# EAGLE schematic OpenDeck-r1.2.2 (EAGLE 7.4.0)
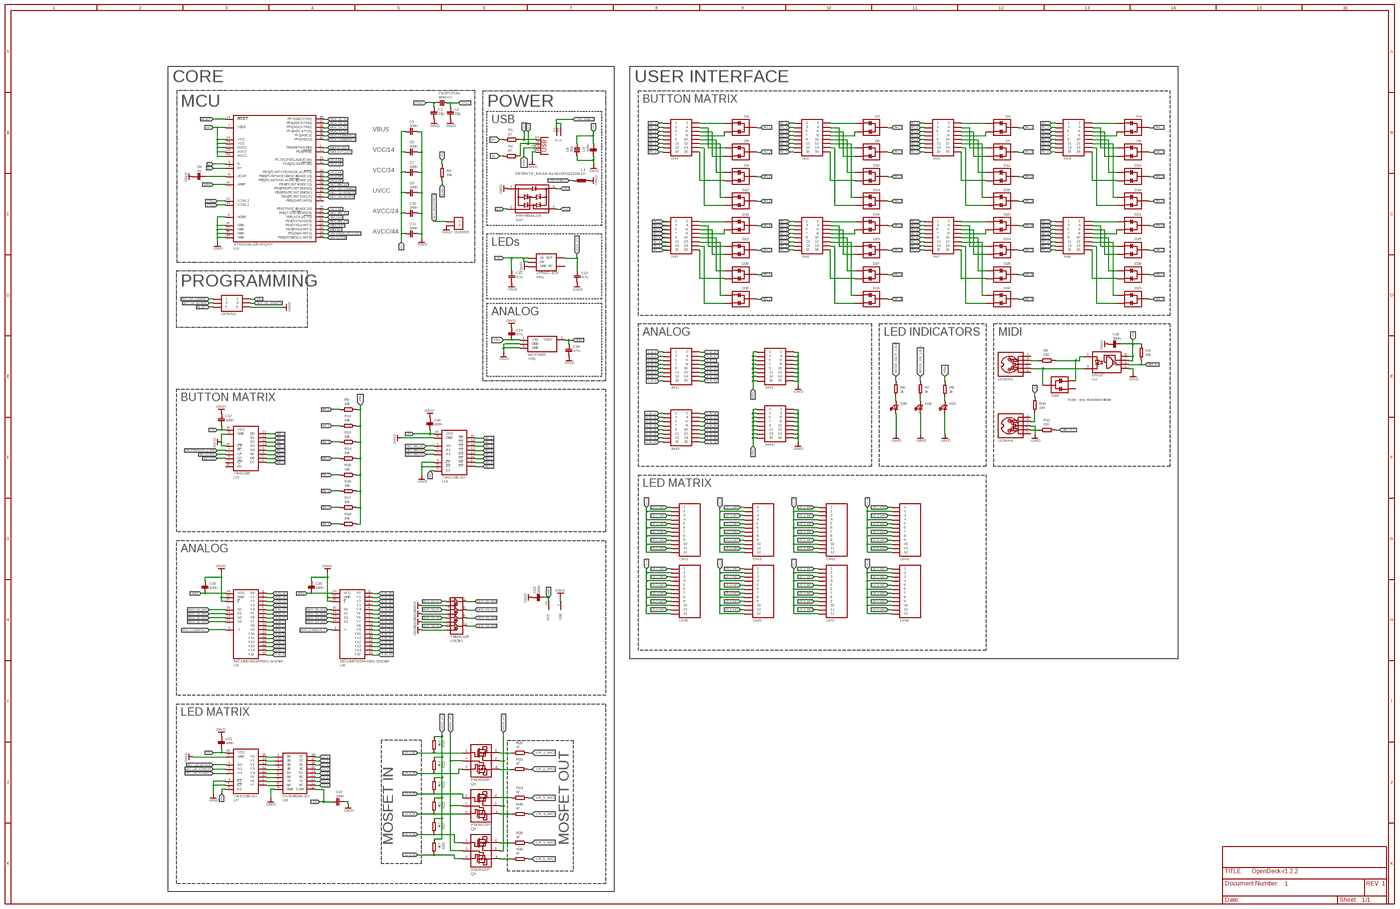
[diagram p0: schematic, sheet 1, overview]
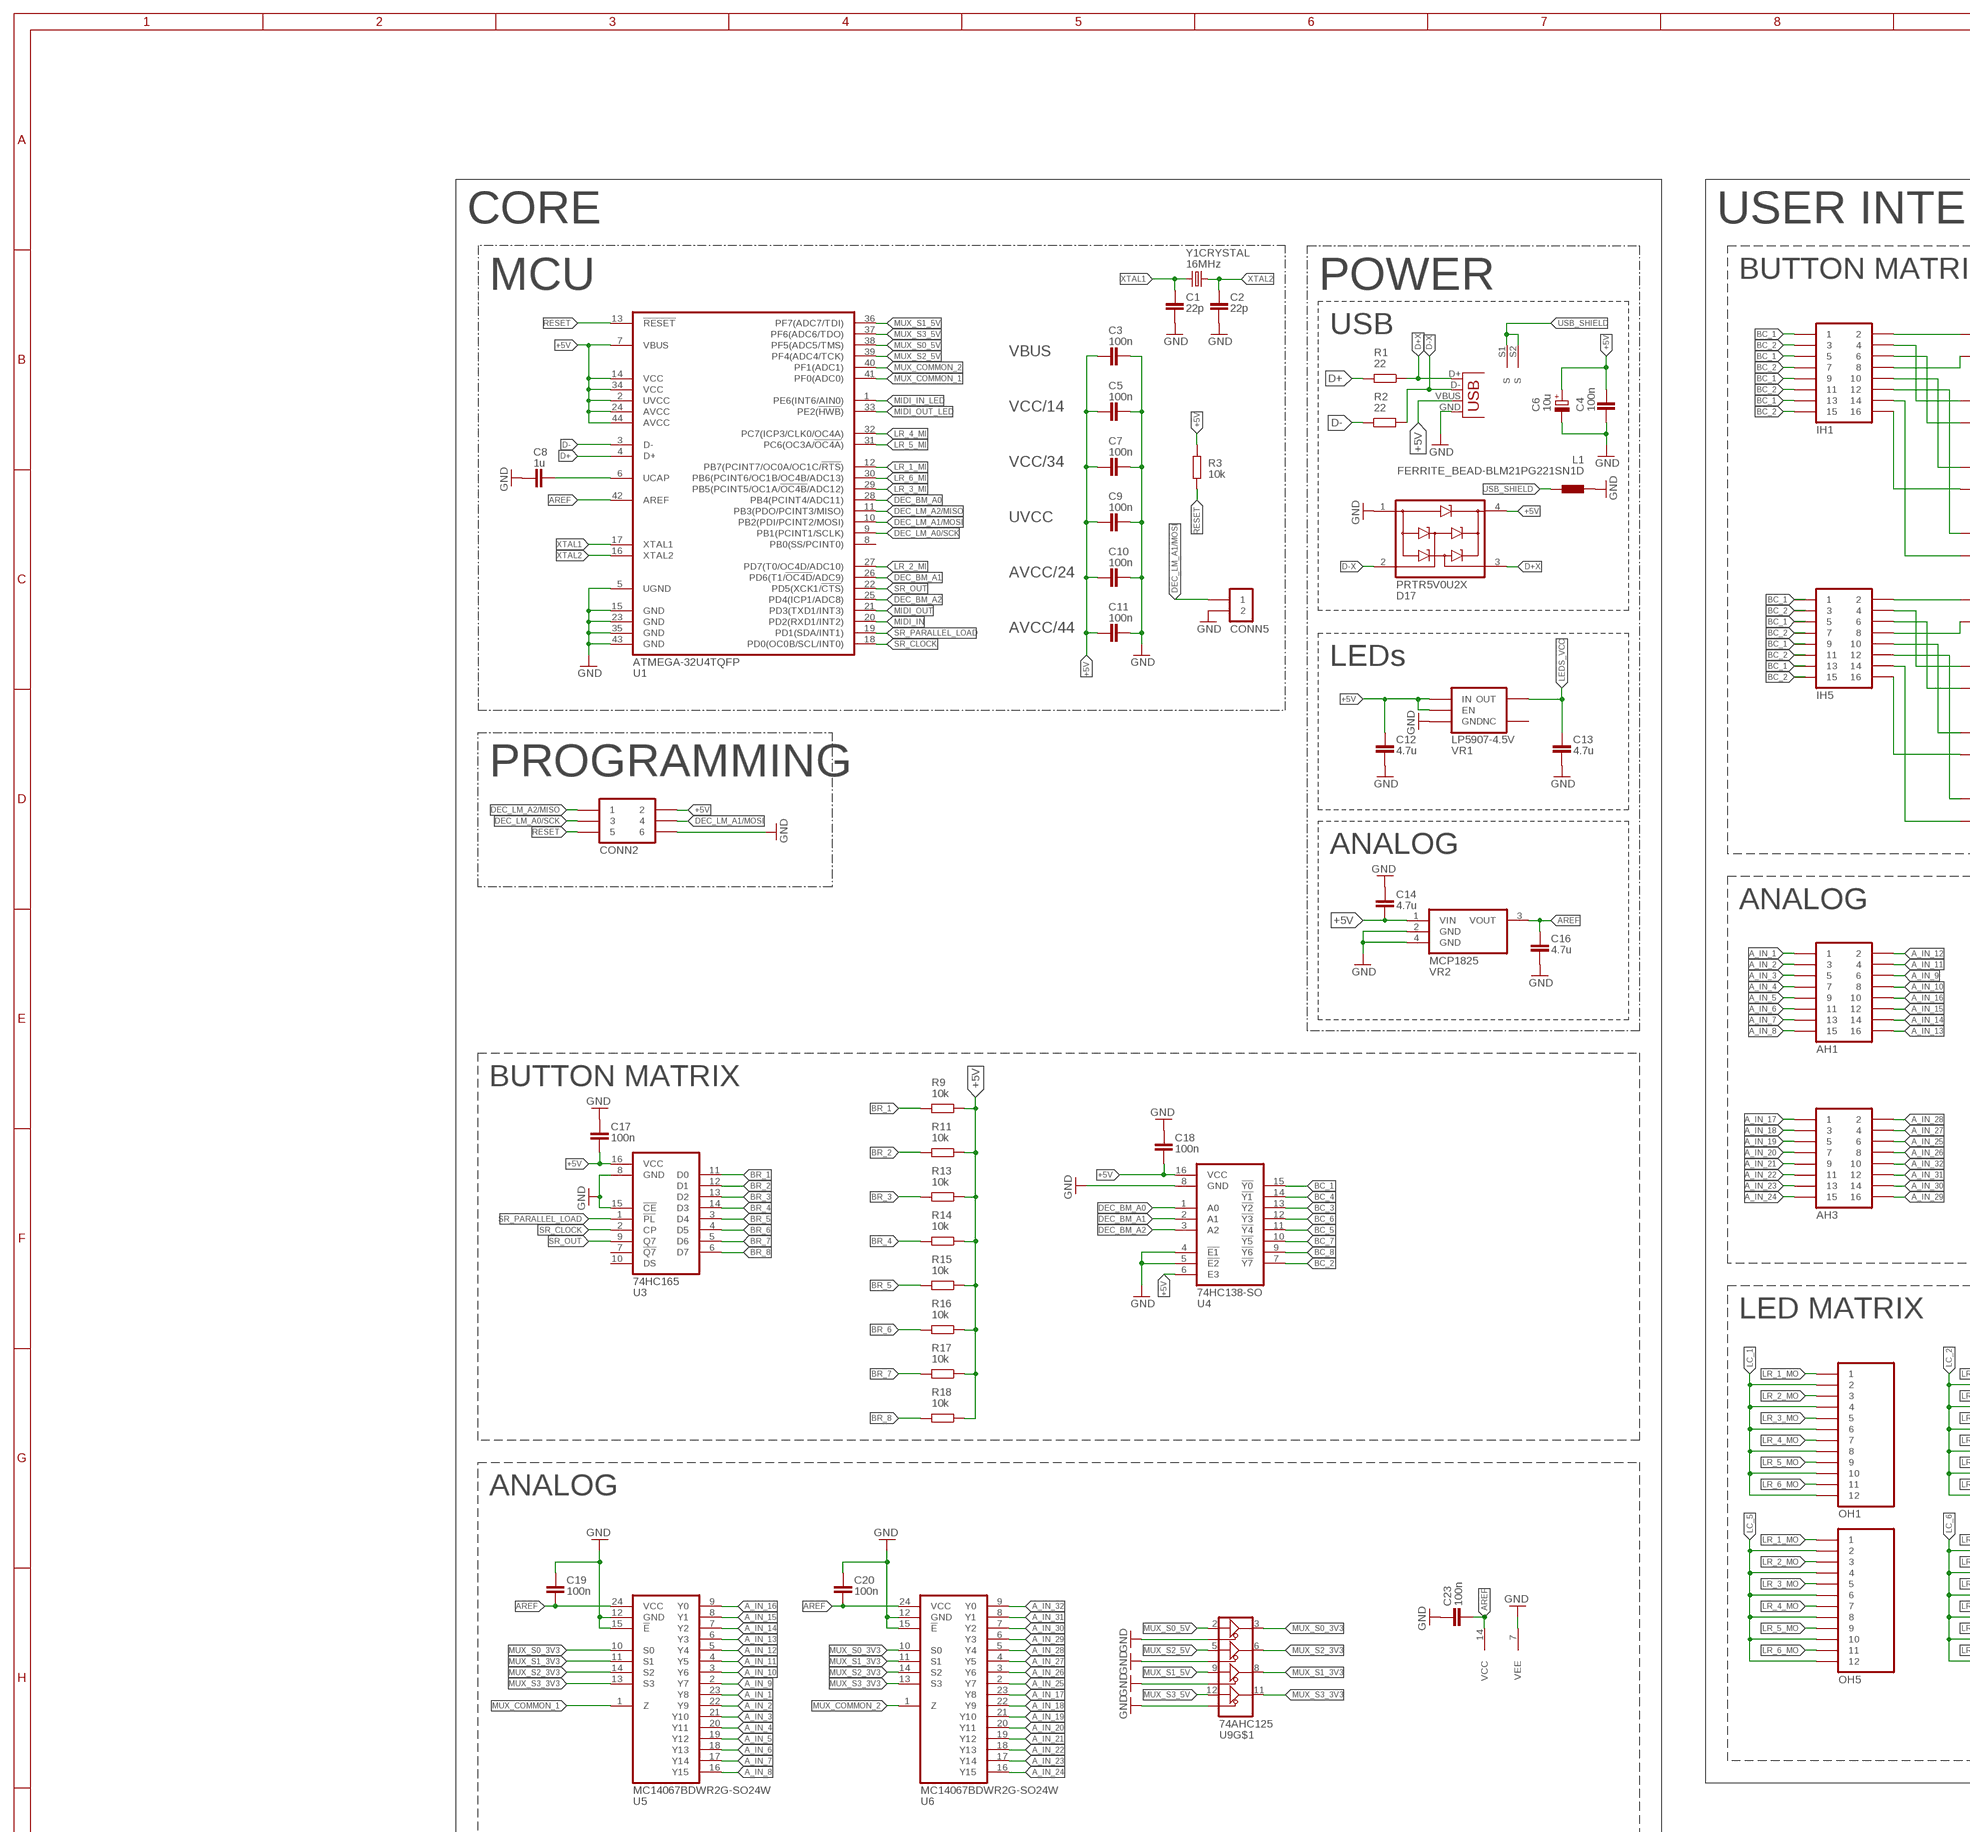
[diagram p1: schematic, sheet 1, part 1 of 4]
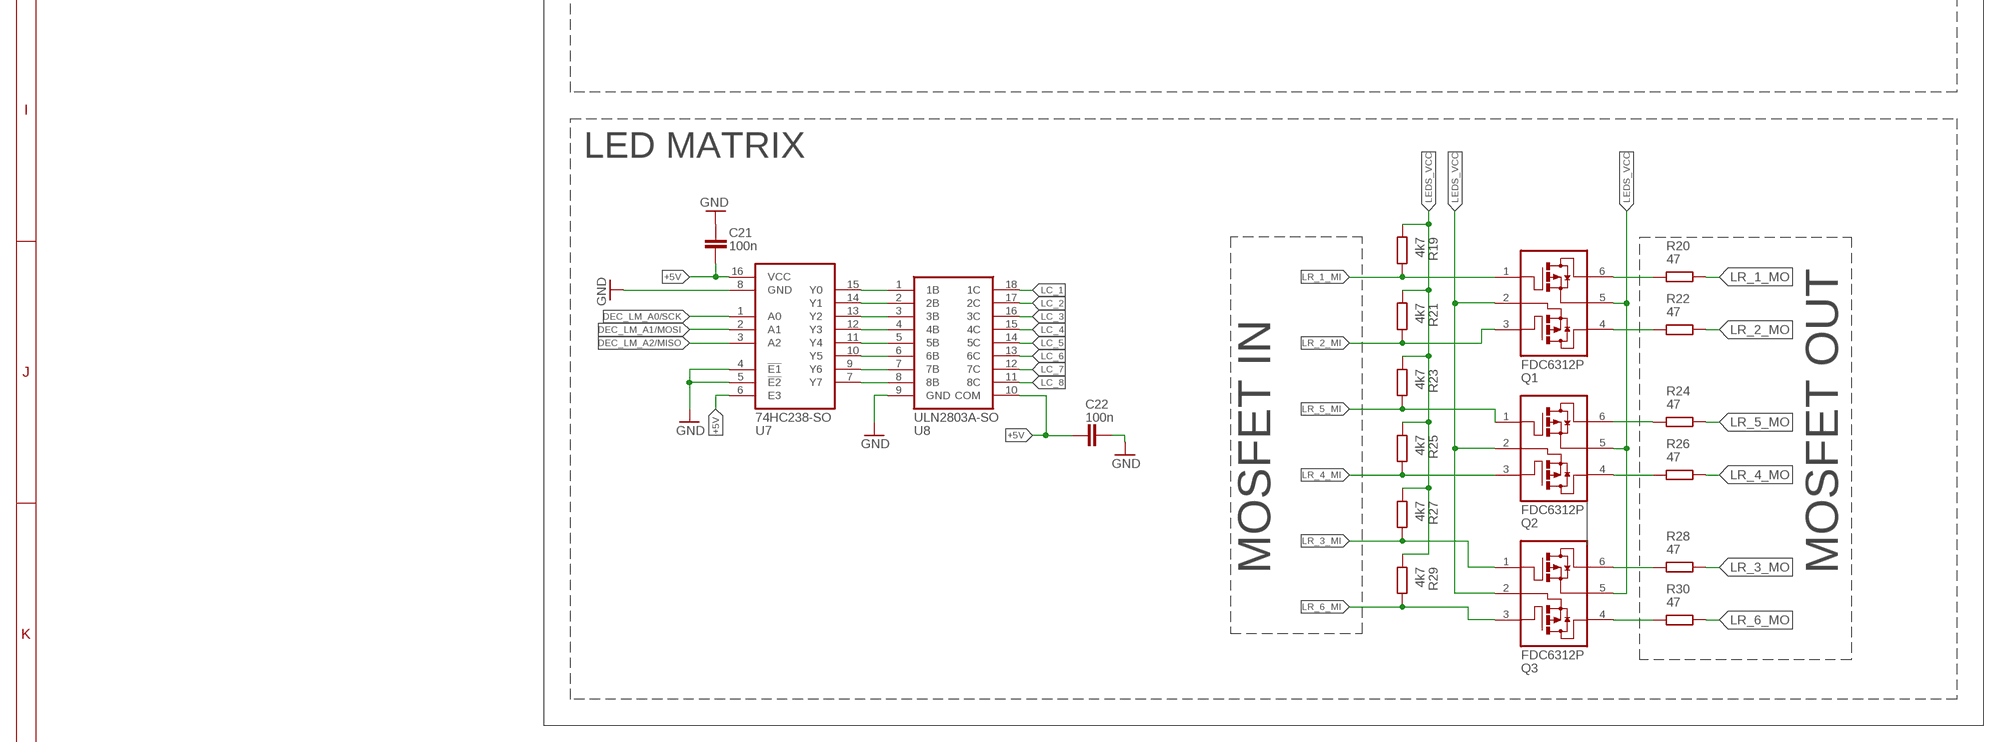
[diagram p2: schematic, sheet 1, part 2 of 4]
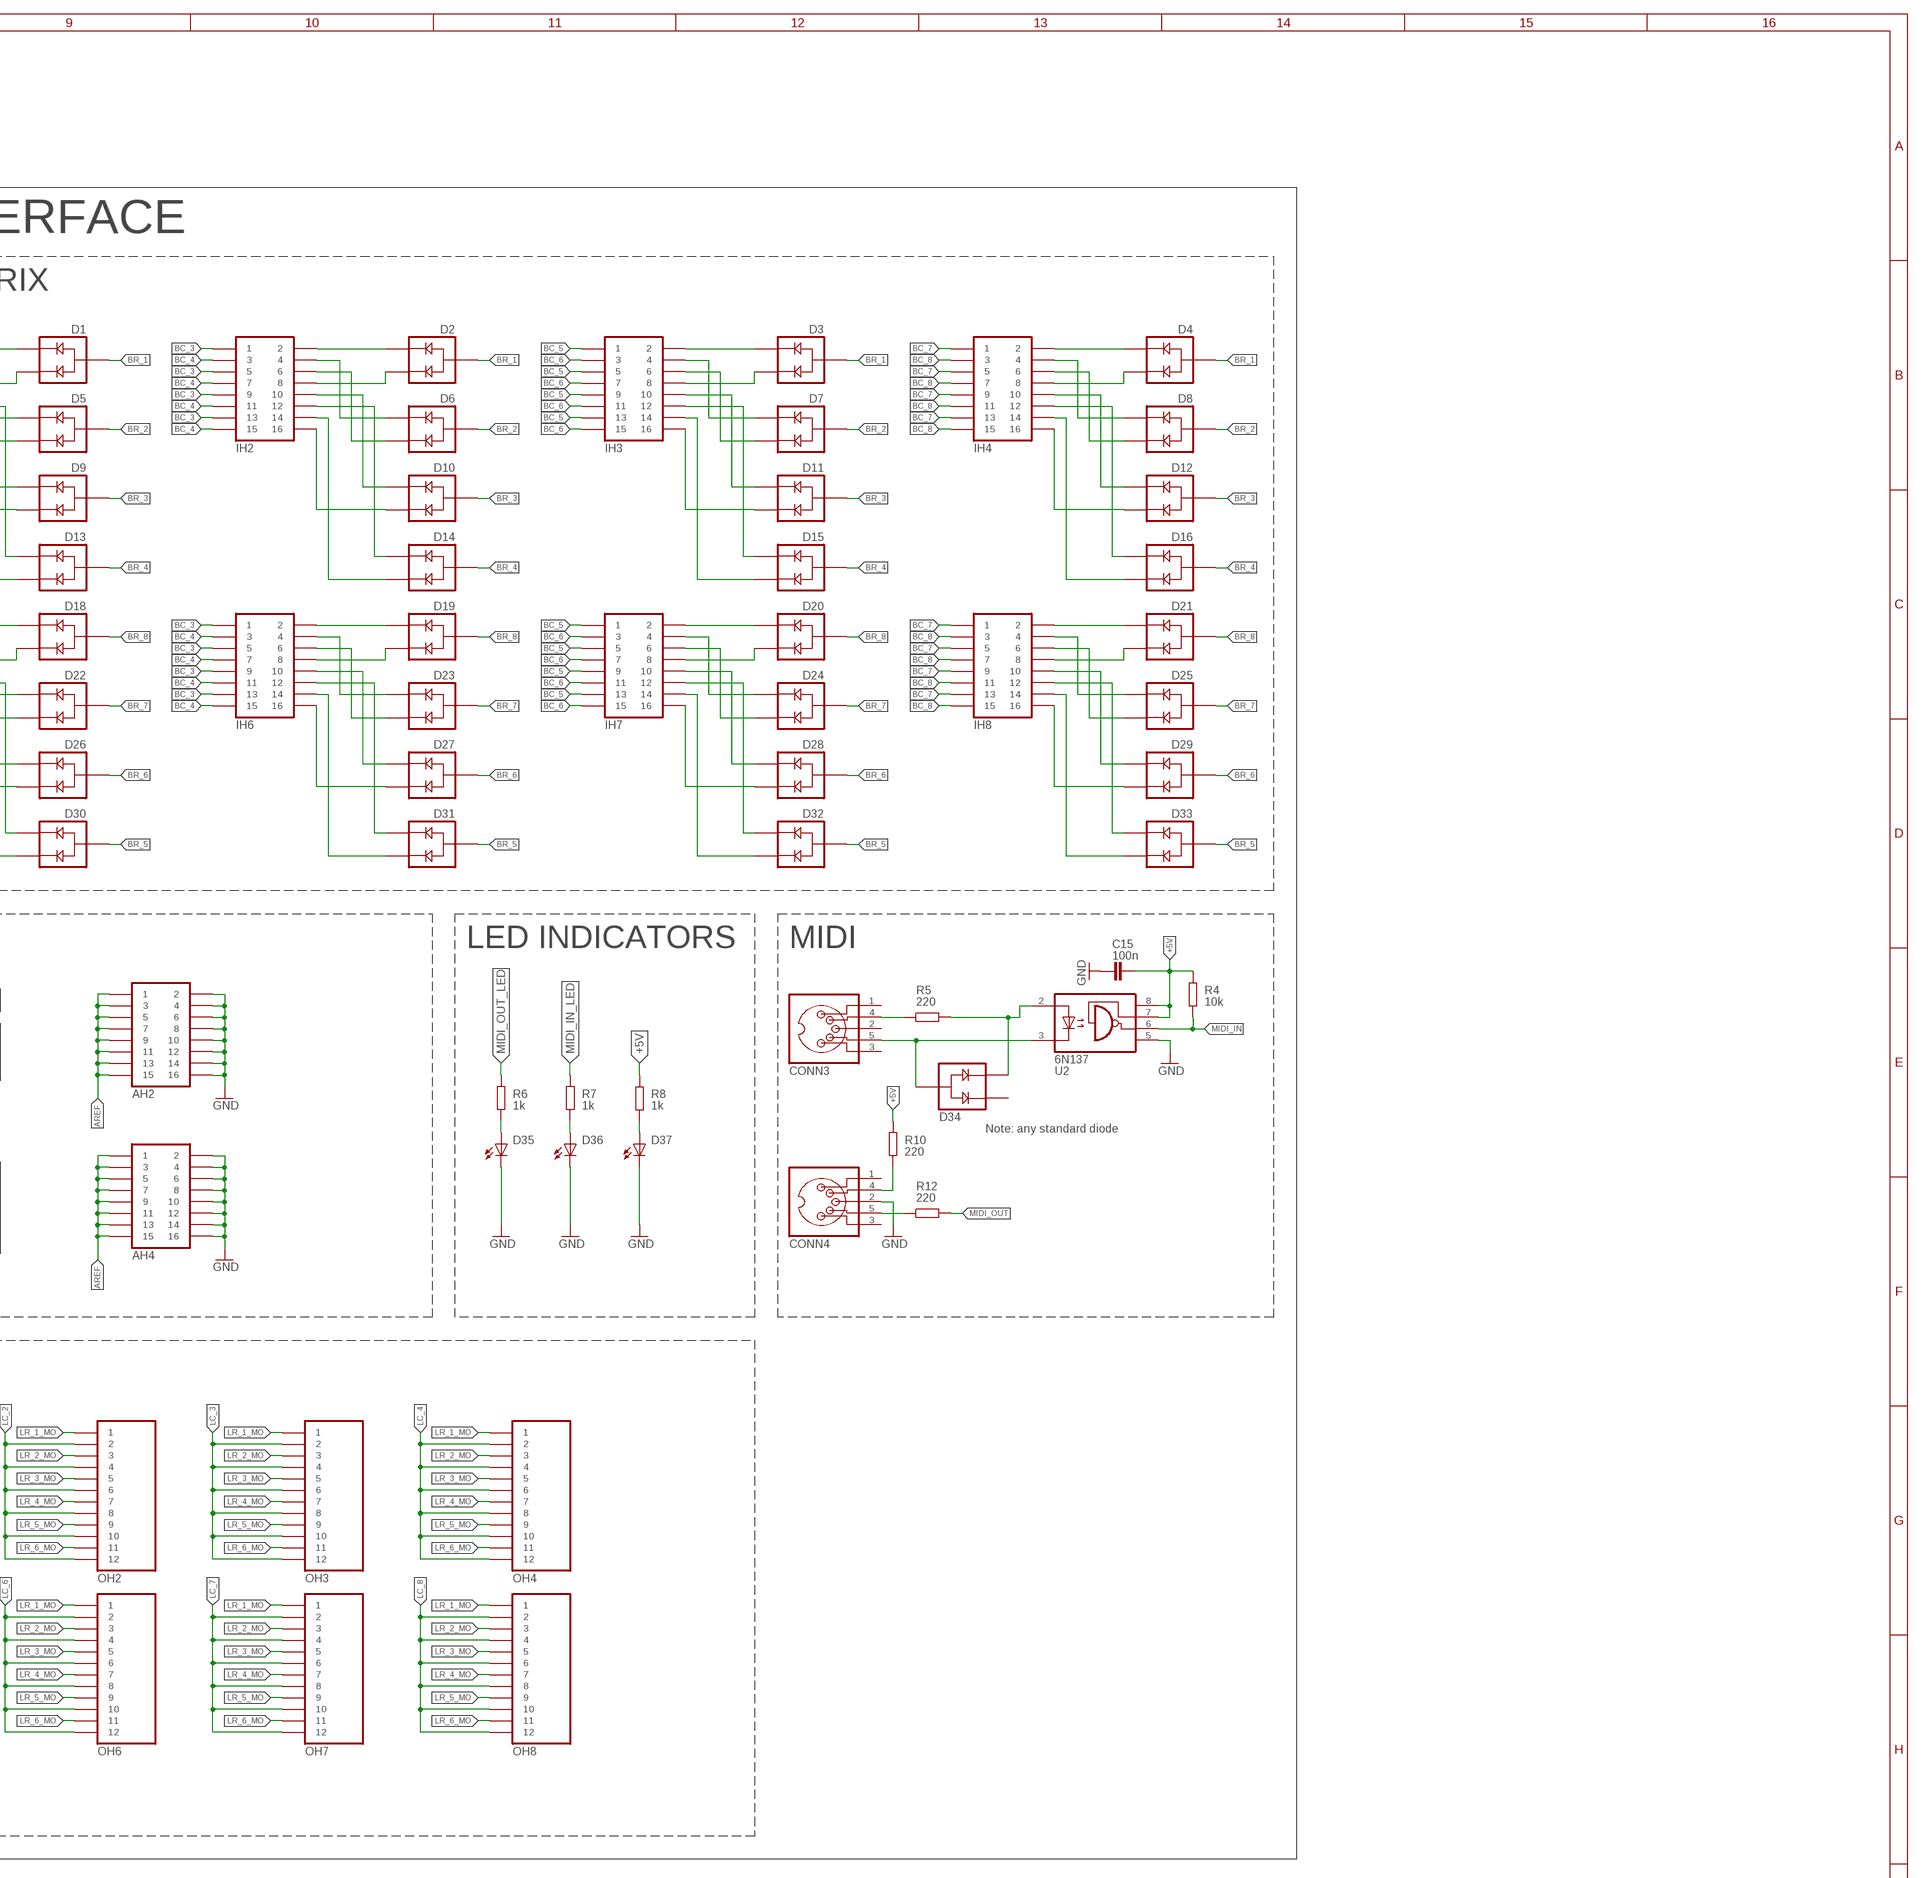
[diagram p3: schematic, sheet 1, part 3 of 4]
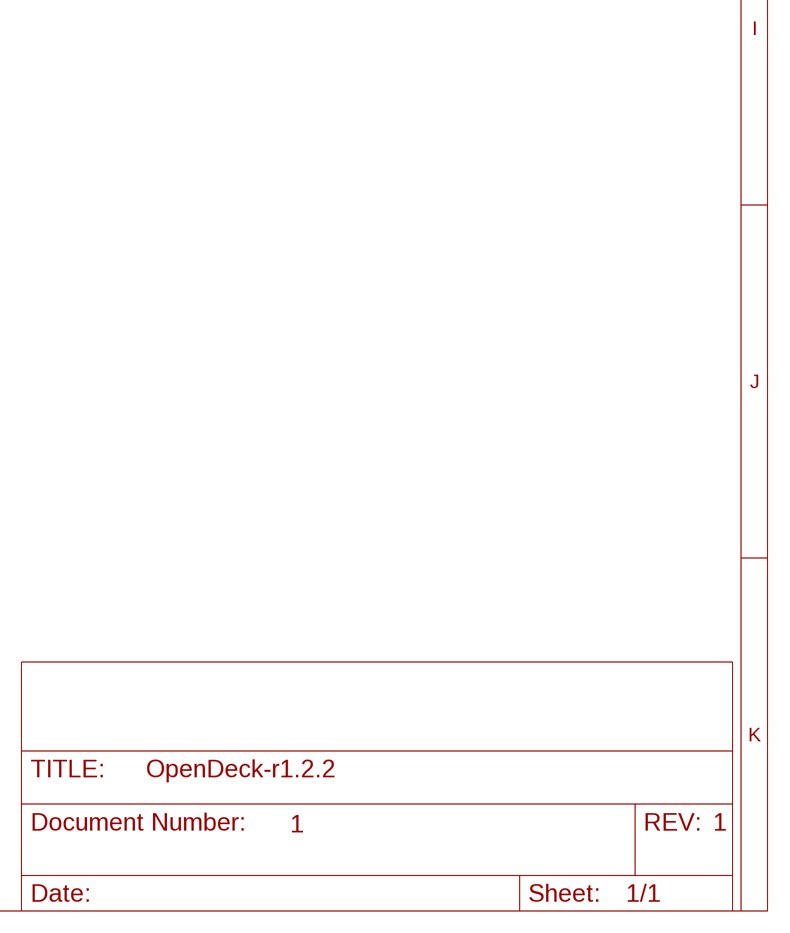
[diagram p4: schematic, sheet 1, part 4 of 4]

## Parts
AH1  PINHD-2X08-TH-2.54MM  [2X08-2.54]
AH2  PINHD-2X08-TH-2.54MM  [2X08-2.54]
AH3  PINHD-2X08-TH-2.54MM  [2X08-2.54]
AH4  PINHD-2X08-TH-2.54MM  [2X08-2.54]
C1  22p  CAPACITOR-0603  [C0603]
C2  22p  CAPACITOR-0603  [C0603]
C3  100n  CAPACITOR-0603  [C0603]
C4  100n  CAPACITOR-0603  [C0603]
C5  100n  CAPACITOR-0603  [C0603]
C6  10u  ELECTROLYTIC_CAPACITOR16V-CLV-0405  [153CLV-0405]
C7  100n  CAPACITOR-0603  [C0603]
C8  1u  CAPACITOR-0603  [C0603]
C9  100n  CAPACITOR-0603  [C0603]
C10  100n  CAPACITOR-0603  [C0603]
C11  100n  CAPACITOR-0603  [C0603]
C12  4.7u  CAPACITOR-0603  [C0603]
C13  4.7u  CAPACITOR-0603  [C0603]
C14  4.7u  CAPACITOR-0603  [C0603]
C15  100n  CAPACITOR-0603  [C0603]
C16  4.7u  CAPACITOR-0603  [C0603]
C17  100n  CAPACITOR-0603  [C0603]
C18  100n  CAPACITOR-0603  [C0603]
C19  100n  CAPACITOR-0603  [C0603]
C20  100n  CAPACITOR-0603  [C0603]
C21  100n  CAPACITOR-0603  [C0603]
C22  100n  CAPACITOR-0603  [C0603]
C23  100n  CAPACITOR-0603  [C0603]
CONN1  USB-B-PTH  [USB-B-PTH]
CONN2  PINHD-2X03-TH-2.54MM-V  [2X03-2.54-V]
CONN3  MIDI_CONN-STD  [DIN5_SUPPORT]
CONN4  MIDI_CONN-STD  [DIN5_SUPPORT]
CONN5  PINHD-1X02-TH-2.54MM  [1X02-2.54-V]
D1  BAW56  [SOT23]
D2  BAW56  [SOT23]
D3  BAW56  [SOT23]
D4  BAW56  [SOT23]
D5  BAW56  [SOT23]
D6  BAW56  [SOT23]
D7  BAW56  [SOT23]
D8  BAW56  [SOT23]
D9  BAW56  [SOT23]
D10  BAW56  [SOT23]
D11  BAW56  [SOT23]
D12  BAW56  [SOT23]
D13  BAW56  [SOT23]
D14  BAW56  [SOT23]
D15  BAW56  [SOT23]
D16  BAW56  [SOT23]
D17  PRTR5V0U2X  [SOT143]
D18  BAW56  [SOT23]
D19  BAW56  [SOT23]
D20  BAW56  [SOT23]
D21  BAW56  [SOT23]
D22  BAW56  [SOT23]
D23  BAW56  [SOT23]
D24  BAW56  [SOT23]
D25  BAW56  [SOT23]
D26  BAW56  [SOT23]
D27  BAW56  [SOT23]
D28  BAW56  [SOT23]
D29  BAW56  [SOT23]
D30  BAW56  [SOT23]
D31  BAW56  [SOT23]
D32  BAW56  [SOT23]
D33  BAW56  [SOT23]
D34  BAW56  [SOT23]
D35  Red  LED-0805  [0805_LED]
D36  Yellow  LED-0805  [0805_LED]
D37  Green  LED-0805  [0805_LED]
IH1  PINHD-2X08-TH-2.54MM  [2X08-2.54]
IH2  PINHD-2X08-TH-2.54MM  [2X08-2.54]
IH3  PINHD-2X08-TH-2.54MM  [2X08-2.54]
IH4  PINHD-2X08-TH-2.54MM  [2X08-2.54]
IH5  PINHD-2X08-TH-2.54MM  [2X08-2.54]
IH6  PINHD-2X08-TH-2.54MM  [2X08-2.54]
IH7  PINHD-2X08-TH-2.54MM  [2X08-2.54]
IH8  PINHD-2X08-TH-2.54MM  [2X08-2.54]
L1  FERRITE_BEAD-BLM21PG221SN1D  [L0805]
OH1  PINHD-2X06-TH-2.54MM  [2X06-2.54-V]
OH2  PINHD-2X06-TH-2.54MM  [2X06-2.54-V]
OH3  PINHD-2X06-TH-2.54MM  [2X06-2.54-V]
OH4  PINHD-2X06-TH-2.54MM  [2X06-2.54-V]
OH5  PINHD-2X06-TH-2.54MM  [2X06-2.54-V]
OH6  PINHD-2X06-TH-2.54MM  [2X06-2.54-V]
OH7  PINHD-2X06-TH-2.54MM  [2X06-2.54-V]
OH8  PINHD-2X06-TH-2.54MM  [2X06-2.54-V]
Q1  FDC6312P  [SSOT6]
Q2  FDC6312P  [SSOT6]
Q3  FDC6312P  [SSOT6]
R1  22  RESISTOR-0603  [R0603]
R2  22  RESISTOR-0603  [R0603]
R3  10k  RESISTOR-0603  [R0603]
R4  10k  RESISTOR-0603  [R0603]
R5  220  RESISTOR-0603  [R0603]
R6  1k  RESISTOR-0603  [R0603]
R7  1k  RESISTOR-0603  [R0603]
R8  1k  RESISTOR-0603  [R0603]
R9  10k  RESISTOR-0603  [R0603]
R10  220  RESISTOR-0603  [R0603]
R11  10k  RESISTOR-0603  [R0603]
R12  220  RESISTOR-0603  [R0603]
R13  10k  RESISTOR-0603  [R0603]
R14  10k  RESISTOR-0603  [R0603]
R15  10k  RESISTOR-0603  [R0603]
R16  10k  RESISTOR-0603  [R0603]
R17  10k  RESISTOR-0603  [R0603]
R18  10k  RESISTOR-0603  [R0603]
R19  4k7  RESISTOR-0603  [R0603]
R20  47  RESISTOR-0603  [R0603]
R21  4k7  RESISTOR-0603  [R0603]
R22  47  RESISTOR-0603  [R0603]
R23  4k7  RESISTOR-0603  [R0603]
R24  47  RESISTOR-0603  [R0603]
R25  4k7  RESISTOR-0603  [R0603]
R26  47  RESISTOR-0603  [R0603]
R27  4k7  RESISTOR-0603  [R0603]
R28  47  RESISTOR-0603  [R0603]
R29  4k7  RESISTOR-0603  [R0603]
R30  47  RESISTOR-0603  [R0603]
U1  ATMEGA-32U4TQFP  [TQFP-44]
U2  6N137  [DIL08]
U3  74HC165  [SO16]
U4  74HC138-SO  [SO16]
U5  MC14067BDWR2G-SO24W  [SO24-W]
U6  MC14067BDWR2G-SO24W  [SO24-W]
U7  74HC238-SO  [SO16]
U8  ULN2803A-SO  [SO18]
U9  74AHC125  [SOIC14]
VR1  LP5907-4.5V  [SOT23-5]
VR2  MCP1825  [SOT223]
Y1  16MHz  CRYSTAL-4P-SMD-3.2X2.5  [CRYSTAL-SMD-3.2X2.5]

## Nets
+5V [vcc]: C3.1 C4.2 C5.1 C6.+ C7.1 C9.1 C10.1 C11.1 C12.1 C14.1 C15.2 C17.2 C18.2 C21.1 C22.1 CONN1.VBUS CONN2.2 D17.4(VCC) R3.1 R4.1 R8.1 R9.1 R10.2 R11.1 R13.1 R14.1 R15.1 R16.1 R17.1 R18.1 U1.2(UVCC) U1.7(VBUS) U1.14(VCC) U1.24(AVCC) U1.34(VCC) U1.44(AVCC) U2.7(VE) U2.8(VCC) U3.16(VCC) U4.6(E3) U4.16(VCC) U7.6(E3) U7.16(VCC) U8.10(COM) VR1.1(IN) VR1.3(EN) VR2.1(VIN)
A_IN_1: AH1.1 U5.23(Y8)
A_IN_2: AH1.3 U5.22(Y9)
A_IN_3: AH1.5 U5.21(Y10)
A_IN_4: AH1.7 U5.20(Y11)
A_IN_5: AH1.9 U5.19(Y12)
A_IN_6: AH1.11 U5.18(Y13)
A_IN_7: AH1.13 U5.17(Y14)
A_IN_8: AH1.15 U5.16(Y15)
A_IN_9: AH1.6 U5.2(Y7)
A_IN_10: AH1.8 U5.3(Y6)
A_IN_11: AH1.4 U5.4(Y5)
A_IN_12: AH1.2 U5.5(Y4)
A_IN_13: AH1.16 U5.6(Y3)
A_IN_14: AH1.14 U5.7(Y2)
A_IN_15: AH1.12 U5.8(Y1)
A_IN_16: AH1.10 U5.9(Y0)
A_IN_17: AH3.1 U6.23(Y8)
A_IN_18: AH3.3 U6.22(Y9)
A_IN_19: AH3.5 U6.21(Y10)
A_IN_20: AH3.7 U6.20(Y11)
A_IN_21: AH3.9 U6.19(Y12)
A_IN_22: AH3.11 U6.18(Y13)
A_IN_23: AH3.13 U6.17(Y14)
A_IN_24: AH3.15 U6.16(Y15)
A_IN_25: AH3.6 U6.2(Y7)
A_IN_26: AH3.8 U6.3(Y6)
A_IN_27: AH3.4 U6.4(Y5)
A_IN_28: AH3.2 U6.5(Y4)
A_IN_29: AH3.16 U6.6(Y3)
A_IN_30: AH3.14 U6.7(Y2)
A_IN_31: AH3.12 U6.8(Y1)
A_IN_32: AH3.10 U6.9(Y0)
AREF: AH2.1 AH2.3 AH2.5 AH2.7 AH2.9 AH2.11 AH2.13 AH2.15 AH4.1 AH4.3 AH4.5 AH4.7 AH4.9 AH4.11 AH4.13 AH4.15 C16.1 C19.2 C20.2 C23.2 U1.42(AREF) U5.24(VCC) U6.24(VCC) U9.14(VCC) VR2.3(VOUT)
BC_1: IH1.1 IH1.5 IH1.9 IH1.13 IH5.1 IH5.5 IH5.9 IH5.13 U4.15(!Y0)
BC_2: IH1.3 IH1.7 IH1.11 IH1.15 IH5.3 IH5.7 IH5.11 IH5.15 U4.7(!Y7)
BC_3: IH2.1 IH2.5 IH2.9 IH2.13 IH6.1 IH6.5 IH6.9 IH6.13 U4.13(!Y2)
BC_4: IH2.3 IH2.7 IH2.11 IH2.15 IH6.3 IH6.7 IH6.11 IH6.15 U4.14(!Y1)
BC_5: IH3.1 IH3.5 IH3.9 IH3.13 IH7.1 IH7.5 IH7.9 IH7.13 U4.11(!Y4)
BC_6: IH3.3 IH3.7 IH3.11 IH3.15 IH7.3 IH7.7 IH7.11 IH7.15 U4.12(!Y3)
BC_7: IH4.1 IH4.5 IH4.9 IH4.13 IH8.1 IH8.5 IH8.9 IH8.13 U4.10(!Y5)
BC_8: IH4.3 IH4.7 IH4.11 IH4.15 IH8.3 IH8.7 IH8.11 IH8.15 U4.9(!Y6)
BR_1: D1.3 D2.3 D3.3 D4.3 R9.2 U3.11(D0)
BR_2: D5.3 D6.3 D7.3 D8.3 R11.2 U3.12(D1)
BR_3: D9.3 D10.3 D11.3 D12.3 R13.2 U3.13(D2)
BR_4: D13.3 D14.3 D15.3 D16.3 R14.2 U3.14(D3)
BR_5: D30.3 D31.3 D32.3 D33.3 R15.2 U3.3(D4)
BR_6: D26.3 D27.3 D28.3 D29.3 R16.2 U3.4(D5)
BR_7: D22.3 D23.3 D24.3 D25.3 R17.2 U3.5(D6)
BR_8: D18.3 D19.3 D20.3 D21.3 R18.2 U3.6(D7)
D+: R1.2 U1.4(D+)
D+X: CONN1.D+ D17.3(I/O2) R1.1
D-: R2.1 U1.3(D-)
D-X: CONN1.D- D17.2(I/O1) R2.2
DEC_BM_A0: U1.28(PB4(PCINT4/ADC11)) U4.1(A0)
DEC_BM_A1: U1.26(PD6(T1/!OC4D!/ADC9)) U4.2(A1)
DEC_BM_A2: U1.25(PD4(ICP1/ADC8)) U4.3(A2)
DEC_LM_A0/SCK: CONN2.3 U1.9(PB1(PCINT1/SCLK)) U7.1(A0)
DEC_LM_A1/MOSI: CONN2.4 CONN5.1 U1.10(PB2(PDI/PCINT2/MOSI)) U7.2(A1)
DEC_LM_A2/MISO: CONN2.1 U1.11(PB3(PDO/PCINT3/MISO)) U7.3(A2)
DEC_LM_Y0: U7.15(Y0) U8.1(1B)
DEC_LM_Y1: U7.14(Y1) U8.2(2B)
DEC_LM_Y2: U7.13(Y2) U8.3(3B)
DEC_LM_Y3: U7.12(Y3) U8.4(4B)
DEC_LM_Y4: U7.11(Y4) U8.5(5B)
DEC_LM_Y5: U7.10(Y5) U8.6(6B)
DEC_LM_Y6: U7.9(Y6) U8.7(7B)
DEC_LM_Y7: U7.7(Y7) U8.8(8B)
GND: AH2.2 AH2.4 AH2.6 AH2.8 AH2.10 AH2.12 AH2.14 AH2.16 AH4.2 AH4.4 AH4.6 AH4.8 AH4.10 AH4.12 AH4.14 AH4.16 C1.2 C2.2 C3.2 C4.1 C5.2 C6.- C7.2 C8.2 C9.2 C10.2 C11.2 C12.2 C13.2 C14.2 C15.1 C16.2 C17.1 C18.1 C19.1 C20.1 C21.2 C22.2 C23.1 CONN1.GND CONN2.6 CONN4.2 CONN5.2 D17.1(GND) D35.C D36.C D37.C L1.1 U1.5(UGND) U1.15(GND) U1.23(GND) U1.35(GND) U1.43(GND) U2.5(GND) U3.8(GND) U3.15(!CE) U4.4(!E1) U4.5(!E2) U4.8(GND) U5.12(GND) U5.15(!E) U6.12(GND) U6.15(!E) U7.4(!E1) U7.5(!E2) U7.8(GND) U8.9(GND) U9.1(1!(OE)) U9.4(2!(OE)) U9.7(VEE) U9.10(3!(OE)) U9.13(4!(OE)) VR1.2(GND) VR2.2(GND) VR2.4(GND)
IH1_2: D1.1 IH1.2
IH1_4: D5.1 IH1.4
IH1_6: D5.2 IH1.6
IH1_8: D1.2 IH1.8
IH1_10: D9.1 IH1.10
IH1_12: D13.1 IH1.12
IH1_14: D13.2 IH1.14
IH1_16: D9.2 IH1.16
IH2_2: D2.1 IH2.2
IH2_4: D6.1 IH2.4
IH2_6: D6.2 IH2.6
IH2_8: D2.2 IH2.8
IH2_10: D10.1 IH2.10
IH2_12: D14.1 IH2.12
IH2_14: D14.2 IH2.14
IH2_16: D10.2 IH2.16
IH3_2: D3.1 IH3.2
IH3_4: D7.1 IH3.4
IH3_6: D7.2 IH3.6
IH3_8: D3.2 IH3.8
IH3_10: D11.1 IH3.10
IH3_12: D15.1 IH3.12
IH3_14: D15.2 IH3.14
IH3_16: D11.2 IH3.16
IH4_2: D4.1 IH4.2
IH4_4: D8.1 IH4.4
IH4_6: D8.2 IH4.6
IH4_8: D4.2 IH4.8
IH4_10: D12.1 IH4.10
IH4_12: D16.1 IH4.12
IH4_14: D16.2 IH4.14
IH4_16: D12.2 IH4.16
IH5_2: D18.1 IH5.2
IH5_4: D22.1 IH5.4
IH5_6: D22.2 IH5.6
IH5_8: D18.2 IH5.8
IH5_10: D26.1 IH5.10
IH5_12: D30.1 IH5.12
IH5_14: D30.2 IH5.14
IH5_16: D26.2 IH5.16
IH6_2: D19.1 IH6.2
IH6_4: D23.1 IH6.4
IH6_6: D23.2 IH6.6
IH6_8: D19.2 IH6.8
IH6_10: D27.1 IH6.10
IH6_12: D31.1 IH6.12
IH6_14: D31.2 IH6.14
IH6_16: D27.2 IH6.16
IH7_2: D20.1 IH7.2
IH7_4: D24.1 IH7.4
IH7_6: D24.2 IH7.6
IH7_8: D20.2 IH7.8
IH7_10: D28.1 IH7.10
IH7_12: D32.1 IH7.12
IH7_14: D32.2 IH7.14
IH7_16: D28.2 IH7.16
IH8_2: D21.1 IH8.2
IH8_4: D25.1 IH8.4
IH8_6: D25.2 IH8.6
IH8_8: D21.2 IH8.8
IH8_10: D29.1 IH8.10
IH8_12: D33.1 IH8.12
IH8_14: D33.2 IH8.14
IH8_16: D29.2 IH8.16
LC_1: OH1.2 OH1.4 OH1.6 OH1.8 OH1.10 OH1.12 U8.18(1C)
LC_2: OH2.2 OH2.4 OH2.6 OH2.8 OH2.10 OH2.12 U8.17(2C)
LC_3: OH3.2 OH3.4 OH3.6 OH3.8 OH3.10 OH3.12 U8.16(3C)
LC_4: OH4.2 OH4.4 OH4.6 OH4.8 OH4.10 OH4.12 U8.15(4C)
LC_5: OH5.2 OH5.4 OH5.6 OH5.8 OH5.10 OH5.12 U8.14(5C)
LC_6: OH6.2 OH6.4 OH6.6 OH6.8 OH6.10 OH6.12 U8.13(6C)
LC_7: OH7.2 OH7.4 OH7.6 OH7.8 OH7.10 OH7.12 U8.12(7C)
LC_8: OH8.2 OH8.4 OH8.6 OH8.8 OH8.10 OH8.12 U8.11(8C)
LEDS_VCC: C13.1 Q1.2(S2) Q1.5(S1) Q2.2(S2) Q2.5(S1) Q3.2(S2) Q3.5(S1) R19.1 R21.1 R23.1 R25.1 R27.1 R29.1 VR1.5(OUT)
LR_1_MI: Q1.1(G1) R19.2 U1.12(PB7(PCINT7/OC0A/OC1C/!RTS!))
LR_1_MO: OH1.1 OH2.1 OH3.1 OH4.1 OH5.1 OH6.1 OH7.1 OH8.1 R20.1
LR_1_MO_R: Q1.6(D1) R20.2
LR_2_MI: Q1.3(G2) R21.2 U1.27(PD7(T0/OC4D/ADC10))
LR_2_MO: OH1.3 OH2.3 OH3.3 OH4.3 OH5.3 OH6.3 OH7.3 OH8.3 R22.2
LR_2_MO_R: Q1.4(D2) R22.1
LR_3_MI: Q3.1(G1) R27.2 U1.29(PB5(PCINT5/OC1A/!OC4B!/ADC12))
LR_3_MO: OH1.5 OH2.5 OH3.5 OH4.5 OH5.5 OH6.5 OH7.5 OH8.5 R28.1
LR_3_MO_R: Q3.6(D1) R28.2
LR_4_MI: Q2.3(G2) R25.2 U1.32(PC7(ICP3/CLK0/OC4A))
LR_4_MO: OH1.7 OH2.7 OH3.7 OH4.7 OH5.7 OH6.7 OH7.7 OH8.7 R26.1
LR_4_MO_R: Q2.4(D2) R26.2
LR_5_MI: Q2.1(G1) R23.2 U1.31(PC6(OC3A/!OC4A!))
LR_5_MO: OH1.9 OH2.9 OH3.9 OH4.9 OH5.9 OH6.9 OH7.9 OH8.9 R24.1
LR_5_MO_R: Q2.6(D1) R24.2
LR_6_MI: Q3.3(G2) R29.2 U1.30(PB6(PCINT6/OC1B/OC4B/ADC13))
LR_6_MO: OH1.11 OH2.11 OH3.11 OH4.11 OH5.11 OH6.11 OH7.11 OH8.11 R30.1
LR_6_MO_R: Q3.4(D2) R30.2
MIDI_IN: R4.2 U1.20(PD2(RXD1/INT2)) U2.6(VO)
MIDI_IN_4: CONN3.4 R5.1
MIDI_IN_5: CONN3.5 D34.3 U2.3(C)
MIDI_IN_DIODE_OUT: D34.2 R5.2 U2.2(A)
MIDI_IN_LED: R7.2 U1.1(PE6(INT6/AIN0))
MIDI_IN_LED_R: D36.A R7.1
MIDI_OUT: R12.2 U1.21(PD3(TXD1/INT3))
MIDI_OUT_4: CONN4.4 R10.1
MIDI_OUT_5: CONN4.5 R12.1
MIDI_OUT_LED: R6.2 U1.33(PE2(!HWB!))
MIDI_OUT_LED_R: D35.A R6.1
MUX_COMMON_1: U1.41(PF0(ADC0)) U5.1(Z)
MUX_COMMON_2: U1.40(PF1(ADC1)) U6.1(Z)
MUX_S0_3V3: U5.10(S0) U6.10(S0) U9.3(1Y)
MUX_S0_5V: U1.38(PF5(ADC5/TMS)) U9.2(1A)
MUX_S1_3V3: U5.11(S1) U6.11(S1) U9.8(3Y)
MUX_S1_5V: U1.36(PF7(ADC7/TDI)) U9.9(3A)
MUX_S2_3V3: U5.14(S2) U6.14(S2) U9.6(2Y)
MUX_S2_5V: U1.39(PF4(ADC4/TCK)) U9.5(2A)
MUX_S3_3V3: U5.13(S3) U6.13(S3) U9.11(4Y)
MUX_S3_5V: U1.37(PF6(ADC6/TDO)) U9.12(4A)
PWR_LED_R: D37.A R8.2
RESET: CONN2.5 R3.2 U1.13(!RESET)
SR_CLOCK: U1.18(PD0(OC0B/SCL/INT0)) U3.2(CP)
SR_OUT: U1.22(PD5(XCK1/!CTS!)) U3.9(Q7)
SR_PARALLEL_LOAD: U1.19(PD1(SDA/INT1)) U3.1(!PL)
UCAP: C8.1 U1.6(UCAP)
USB_SHIELD: CONN1.S1(S) CONN1.S2(S) L1.2
XTAL1: C1.1 U1.17(XTAL1) Y1.3
XTAL2: C2.1 U1.16(XTAL2) Y1.1
Unconnected: CONN3.1 CONN3.2 CONN3.3 CONN4.1 CONN4.3 D34.1 U1.8(PB0(SS/PCINT0)) U3.7(!Q7) U3.10(DS) VR1.4(NC) Y1.2(GND1:VEE) Y1.4(GND2:VEE)

## Notes on the sheet
- CORE | USER INTERFACE
- BUTTON MATRIX
- MCU | POWER
- USB
- VBUS
- VCC/14
- VCC/34
- UVCC
- AVCC/24
- AVCC/44
- LEDs
- PROGRAMMING
- ANALOG
- ANALOG | LED INDICATORS | MIDI
- BUTTON MATRIX | Note: any standard diode
- LED MATRIX
- ANALOG
- LED MATRIX
- MOSFET IN | MOSFET OUT
- 1 | 1

## Library data of the parts
AH1-AH4 IH1-IH8 = igor_lbr:PINHD-2X08: Pin Header
C1-C5 C7-C23 = igor_lbr:CAPACITOR: Capacitor
C6 = igor_lbr:ELECTROLYTIC_CAPACITOR: Electrolytic capacitor; MANUFACTURER: Multicomp; MPN: MCVVT016M100CA1L
CONN1 = igor_lbr:USB: USB B connector, horizontal
CONN2 = igor_lbr:PINHD-2X03: Pin Header
CONN3 CONN4 = igor_lbr:MIDI_CONN: DIN MIDI connector
CONN5 = igor_lbr:PINHD-1X02: Pin Header
D1-D16 D18-D34 = igor_lbr:BAW56: Small Signal Diode; MANUFACTURER: Multicomp; MPN: BAW56-7-F
D17 = igor_lbr:PRTR5V0U2X: Ultra low capacitance double rail-to-rail ESD protection diode; MANUFACTURER: Nexperia; MPN: PRTR5V0U2X
D35-D37 = igor_lbr:LED: LED
L1 = igor_lbr:FERRITE_BEAD: Ferrite Bead; MANUFACTURER: Murata; MPN: BLM21PG221SN1D
OH1-OH8 = igor_lbr:PINHD-2X06: Pin Header
Q1-Q3 = igor_lbr:FDC6312P: Dual P-channel 1.8V PowerTrench Specified MOSFET; MANUFACTURER: ON Semiconductor; MPN: FDC6312P
R1-R30 = igor_lbr:RESISTOR: Resistor
U1 = igor_lbr:ATMEGA-32U4: 8-bit Microcontroller with 16/32 Bytes of ISP Flash and USB Controller; MPN: ATMEGA32U4-AUR
U2 = igor_lbr:6N137: High Speed Optocoupler; MANUFACTURER: Vishay; MPN: 6N137
U3 = igor_lbr:74*165: 8-bit parallel-in/serial out shift register; MANUFACTURER: Nexperia; MPN: 74HC165D
U4 = igor_lbr:74*138: 3-to-8 line decoder/demultiplexer; inverting; MANUFACTURER: Nexperia; MPN: 74HC138D
U5 U6 = igor_lbr:MC14067BDWR2G: 16-Channel Analog Multiplexer/Demultiplexer; MANUFACTURER: ON Semiconductor; MPN: MC14067BDWR2G
U7 = igor_lbr:74*238: 74HC238/74HCT238 3-to-8 line decoder/demultiplexer; MANUFACTURER: Nexperia; MPN: 74HC238D
U8 = igor_lbr:ULN2803A: ULN2803A Darlington Transistor Arrays; MANUFACTURER: Texas Instruments; MPN: ULN2803ADWR
U9 = igor_lbr:74AHC125: Quad buffer/line driver; MANUFACTURER: Texas Instruments; MPN: SN74AHC125DR
VR1 = igor_lbr:LP5907: Ultra Low-Noise, 250-mA Linear LDO Regulator; MANUFACTURER: Texas Instruments; MPN: LP5907MFX-4.5/NOPB
VR2 = igor_lbr:MCP1825: 500 mA, Low Voltage, Low Quiescent Current LDO Regulator; MANUFACTURER: Microchip; MPN: MCP1825S-3302E/DB
Y1 = igor_lbr:CRYSTAL-4P: Crystal; MANUFACTURER: TXC; MPN: 887-1424-1-ND

## Net classes
0 default: width 0.203 mm
1 vcc: width 0.254 mm